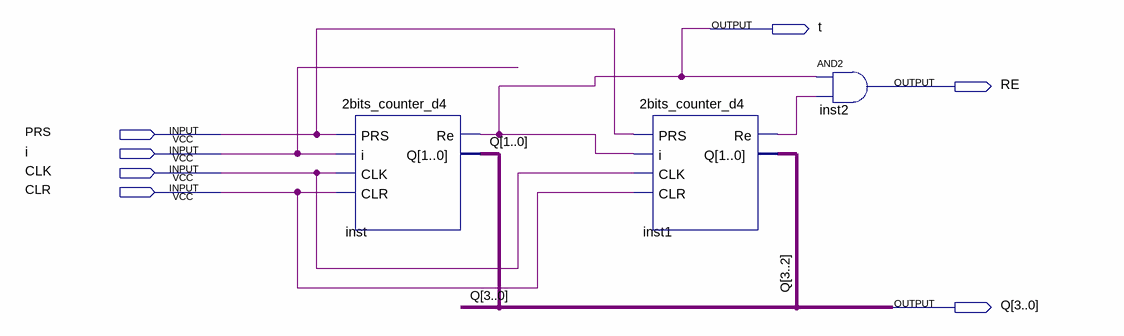
[diagram p0: schematic sheet]
// Quartus schematic test4.bdf as structural Verilog: 3 symbols, 7 pins
module test4 (
  input  PRS,
  input  i,
  input  CLK,
  input  CLR,
  output t,
  output RE,
  output [3:0] Q
);

  wire inst1_re;

  \2bits_counter_d4  inst (.PRS(PRS), .i(i), .CLK(CLK), .CLR(CLR), .Re(t), .Q(Q[1:0]));
  \2bits_counter_d4  inst1 (.PRS(PRS), .i(t), .CLK(CLK), .CLR(CLR), .Re(inst1_re), .Q(Q[3:2]));
  and inst2 (RE, t, inst1_re);
endmodule
